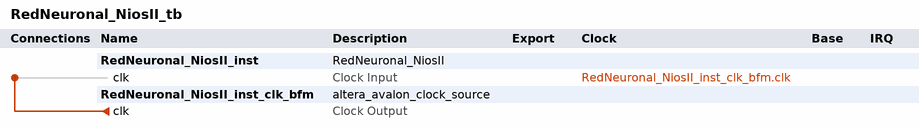
[diagram p0: system contents]
# Platform Designer (Qsys) system RedNeuronal_NiosII_tb, Cyclone V 5CSXFC6D6F31C6
# Parameters at their usual value, and those the tool derives, are not listed.
package require -exact qsys 18.1
create_system RedNeuronal_NiosII_tb
set_project_property DEVICE_FAMILY {Cyclone V}
set_project_property DEVICE 5CSXFC6D6F31C6

add_instance RedNeuronal_NiosII_inst RedNeuronal_NiosII 1.0

add_instance RedNeuronal_NiosII_inst_clk_bfm altera_avalon_clock_source 18.1

# connections
add_connection RedNeuronal_NiosII_inst_clk_bfm.clk RedNeuronal_NiosII_inst.clk clock

set_interconnect_requirement {$system} qsys_mm.clockCrossingAdapter HANDSHAKE
set_interconnect_requirement {$system} qsys_mm.enableEccProtection FALSE
set_interconnect_requirement {$system} qsys_mm.insertDefaultSlave FALSE
set_interconnect_requirement {$system} qsys_mm.maxAdditionalLatency 1

save_system RedNeuronal_NiosII_tb.qsys
